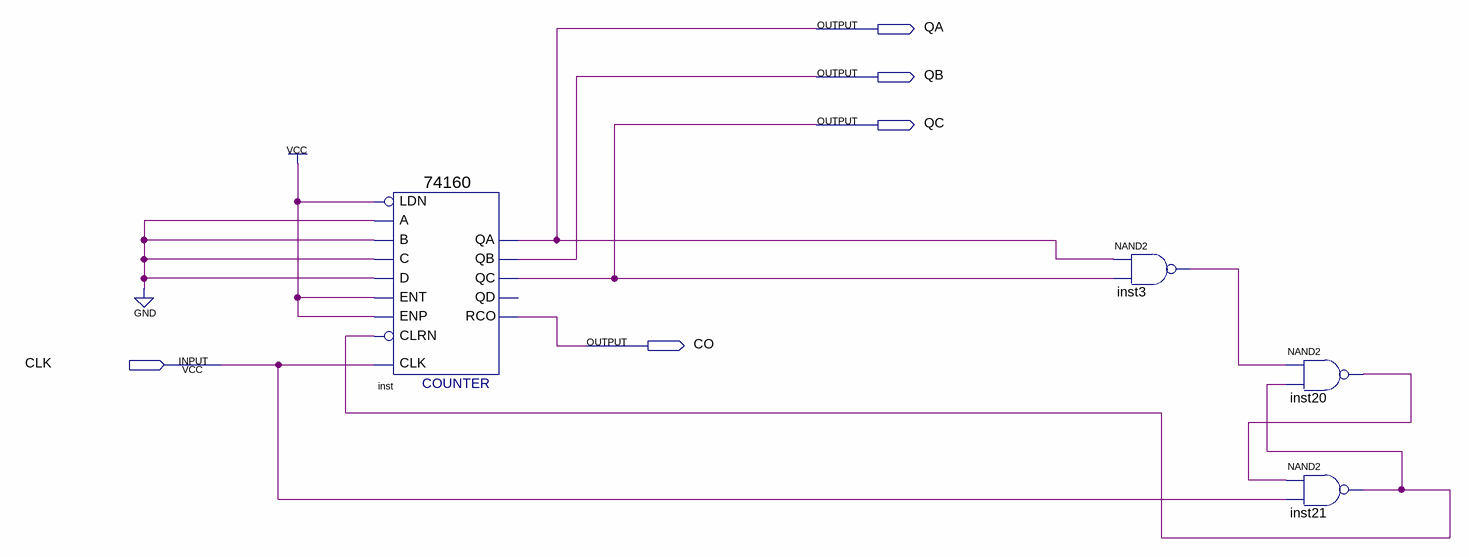
[diagram p0: schematic sheet]
// Quartus schematic Block1.bdf as structural Verilog: 4 symbols, 5 pins
module Block1 (
  input  CLK,
  output QA,
  output QB,
  output QC,
  output CO
);

  wire inst3_out, inst20_out, inst21_out;

  \74160  inst (
    .CLK(CLK), .ENT(1'b1), .A(1'b0), .B(1'b0), .C(1'b0), .D(1'b0), .LDN(1'b1), .ENP(1'b1), .CLRN(inst21_out),
    .QA(QA), .QB(QB), .QC(QC), .RCO(CO));  // open: QD
  nand inst3 (inst3_out, QA, QC);
  nand inst20 (inst20_out, inst3_out, inst21_out);
  nand inst21 (inst21_out, inst20_out, CLK);
endmodule
